# Altium schematic sheet PL2812B.SchDoc: XMOD FT2232H
size A4; Organization: Trenz Electronic GmbH; DocumentNumber: XMOD FT2232H; Revision: 01; SheetNumber: 1; SheetTotal: 3; Date: 2015-01-06; Author: Indrek Tubalkain; DrawnBy: Indrek Tubalkain; Engineer: Indrek Tubalkain
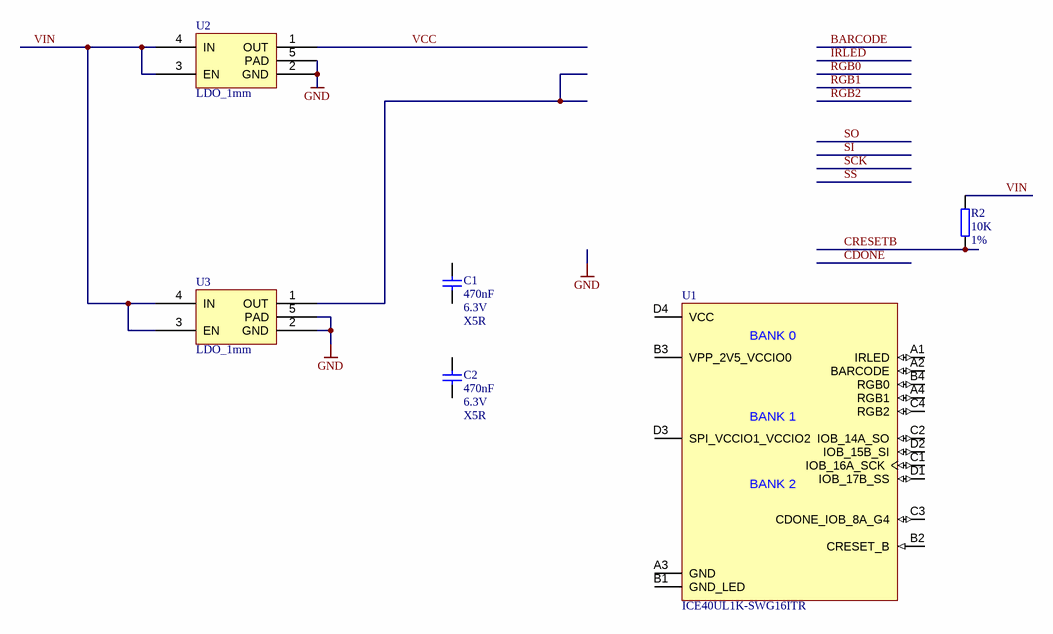
[diagram p0: PL2812B.SchDoc]

## Parts
C1  470nF  Voltage: 6.3V  Technology: X5R  [CAPC0603X33N]
C2  470nF  Voltage: 6.3V  Technology: X5R  [CAPC0603X33N]
R2  10K  Tolerance: 1%  [RESC0603X26N]
U1  ICE40UL1K-SWG16ITR  [BGA16C35P4X4_140X140X49B21N]
U2  LDO_1mm  [DFN65P100X45-4N]
U3  LDO_1mm  [DFN65P100X45-4N]

## Nets
GND: U2.2(GND) U2.5(PAD) U3.2(GND) U3.5(PAD)
CRESETB: R2.2
VCC: U2.1(OUT)
VIN: R2.1 U2.3(EN) U2.4(IN) U3.3(EN) U3.4(IN)

Not connected (* = marked no-connect by the designer): C1 1 2; C2 1 2; U1 A1(IRLED) A2(BARCODE) A3(GND) A4(RGB1) B1(GND_LED) B2(CRESET_B) B3(VPP_2V5_VCCIO0) B4(RGB0) C1(IOB_16A_SCK) C2(IOB_14A_SO) C3(CDONE_IOB_8A_G4) C4(RGB2) D1(IOB_17B_SS) D2(IOB_15B_SI) D3(SPI_VCCIO1_VCCIO2) D4(VCC); U3 1(OUT)

## Notes on the sheet
- Title:
- Number:
- Rev.
- Date:
- A4
- Copyright:
- Page
- of
- Filename:
- (in symbol 26737) BANK 0; BANK 1; BANK 2

## Library data of the parts
C1 C2 = 24921: KON 470nF X5R 6.3V SMD 20%; AN: 24921; Mixed: SMT; Value: 470n; Preferred: Yes; Case: 0603 (0201); Tolerance: 20%
R2 = 24914: WID SMD 10K 1% 0,05W; AN: 24914; Mixed: SMT; Preferred: Yes; Case: 0603 (0201); Value: 10K; HelpURL: B:\AD\adlib\datasheet\R0201
U1 = 26737: AN: 26737; Mixed: SMT; Case: WLCSP16; HelpURL: B:\AD\adlib\datasheet\ICE40